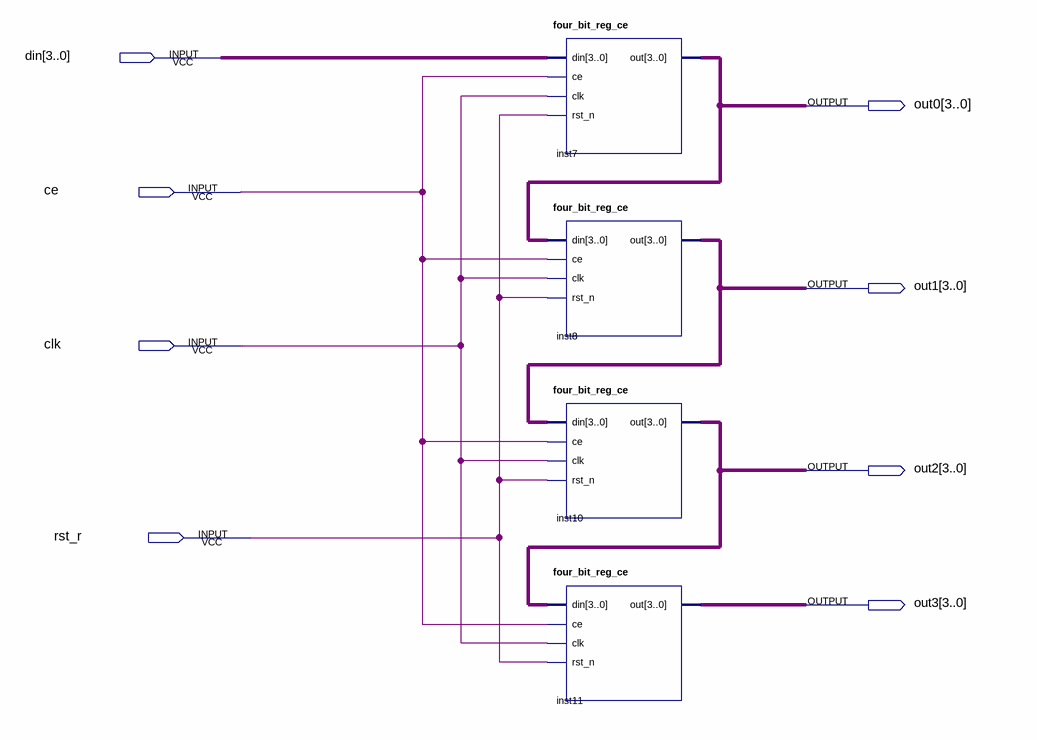
[diagram p0: schematic sheet]
// Quartus schematic four_register_holder.bdf as structural Verilog: 4 symbols, 8 pins
module four_register_holder (
  input  [3:0] din,
  input  ce,
  input  clk,
  input  rst_r,
  output [3:0] out0,
  output [3:0] out1,
  output [3:0] out2,
  output [3:0] out3
);

  four_bit_reg_ce inst7 (.din(din), .ce(ce), .clk(clk), .rst_n(rst_r), .out(out0));
  four_bit_reg_ce inst8 (.din(out0), .ce(ce), .clk(clk), .rst_n(rst_r), .out(out1));
  four_bit_reg_ce inst10 (.din(out1), .ce(ce), .clk(clk), .rst_n(rst_r), .out(out2));
  four_bit_reg_ce inst11 (.din(out2), .ce(ce), .clk(clk), .rst_n(rst_r), .out(out3));
endmodule
